# Altium schematic sheet Voltage Source.SchDoc
size A3; SheetNumber: 3; SheetTotal: 5
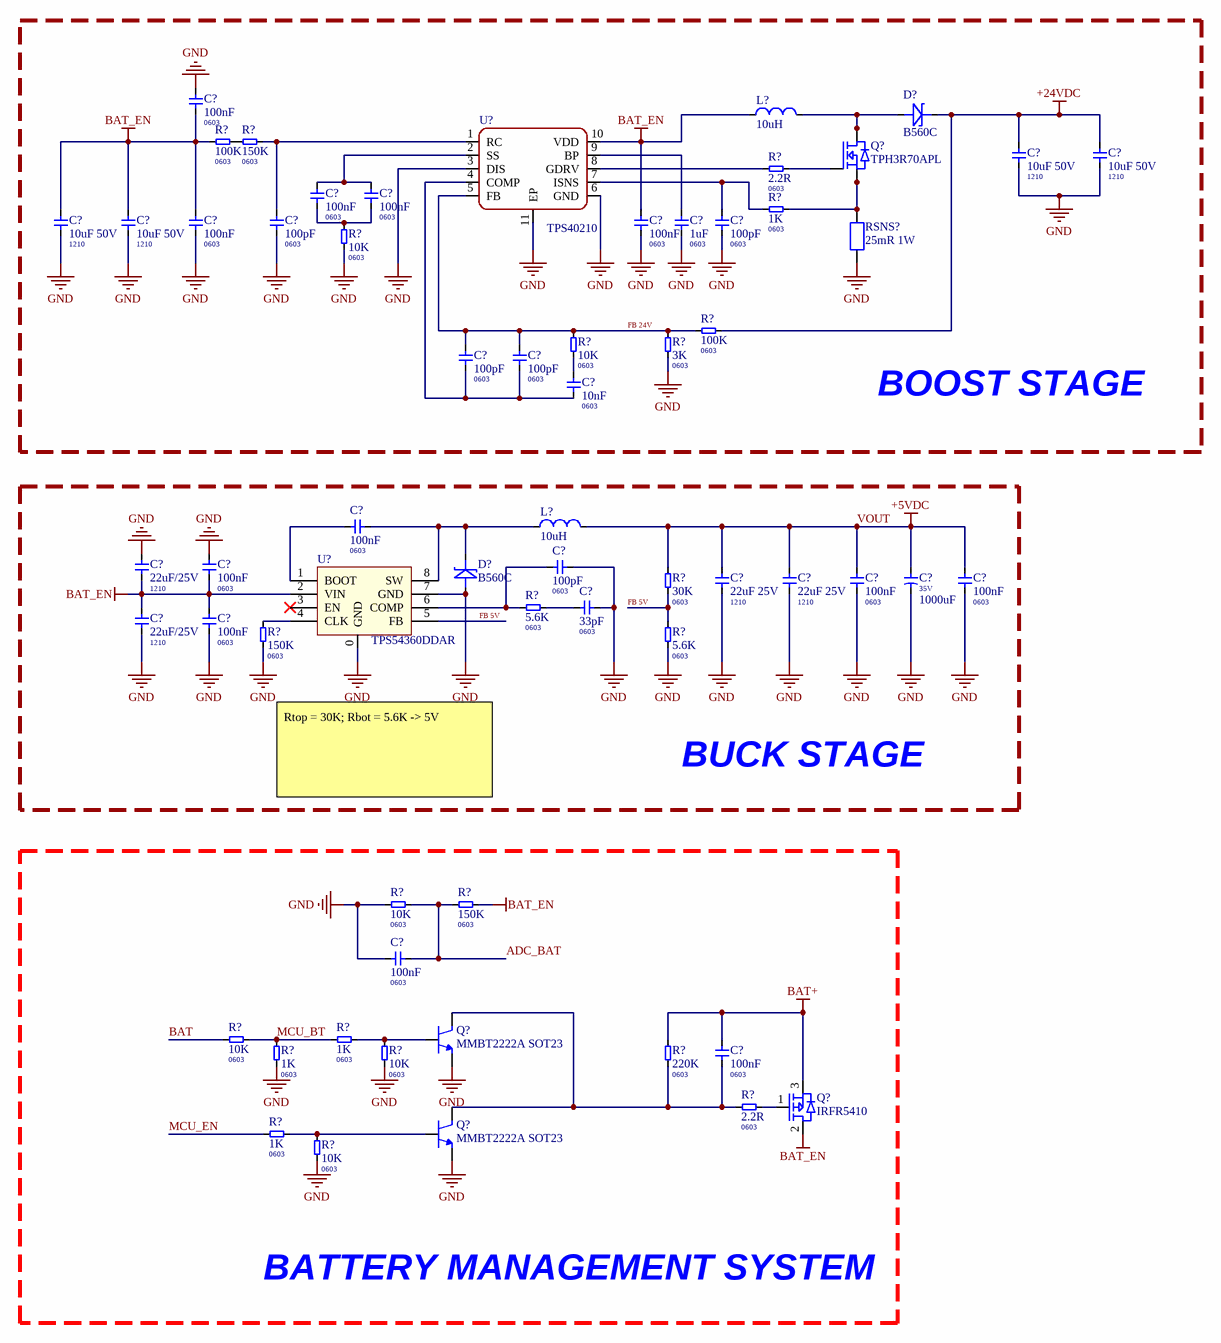
[diagram p0: Voltage Source.SchDoc]

## Parts
(Parts that share a designator on the sheet are numbered #1, #2 ... from top to bottom, then left to right.)
C?#1  100nF  Package: 0603  [0603 MLCC]
C?#2  10uF 50V  Package: 1210  [1210 CAPACITOR]
C?#3  10uF 50V  Package: 1210  [1210 CAPACITOR]
C?#4  100nF  Package: 0603  [0603 MLCC]
C?#5  100nF  Package: 0603  [0603 MLCC]
C?#6  10uF 50V  Package: 1210  [1210 CAPACITOR]
C?#7  10uF 50V  Package: 1210  [1210 CAPACITOR]
C?#8  100nF  Package: 0603  [0603 MLCC]
C?#9  100pF  Package: 0603  [0603 MLCC]
C?#10  100nF  Package: 0603  [0603 MLCC]
C?#11  1uF  Package: 0603  [0603 MLCC]
C?#12  100pF  Package: 0603  [0603 MLCC]
C?#13  100pF  Package: 0603  [0603 MLCC]
C?#14  100pF  Package: 0603  [0603 MLCC]
C?#15  10nF  Package: 0603  [0603 MLCC]
C?#16  100nF  Package: 0603  [0603 MLCC]
C?#17  22uF/25V  Package: 1210  [1210 CAPACITOR]
C?#18  100nF  Package: 0603  [0603 MLCC]
C?#19  100pF  Package: 0603  [0603 MLCC]
C?#20  22uF 25V  Package: 1210  [1210 CAPACITOR]
C?#21  22uF 25V  Package: 1210  [1210 CAPACITOR]
C?#22  100nF  Package: 0603  [0603 MLCC]
C?#23  Voltage: 35V  Capacitor: 1000uF  [10x20 5.0 Capacitor]  (hidden comment: 1000uF/35V)
C?#24  100nF  Package: 0603  [0603 MLCC]
C?#25  33pF  Package: 0603  [0603 MLCC]
C?#26  22uF/25V  Package: 1210  [1210 CAPACITOR]
C?#27  100nF  Package: 0603  [0603 MLCC]
C?#28  100nF  Package: 0603  [0603 MLCC]
C?#29  100nF  Package: 0603  [0603 MLCC]
D?#1  B560C  [SMC(DO-214AB)]
D?#2  B560C  [SMC(DO-214AB)]
L?#1  10uH  [12.2x12.2mm]
L?#2  10uH  [12.2x12.2mm]
Q?#1  TPH3R70APL  [SOP Advanced]
Q?#2  MMBT2222A SOT23  [SOT23_HVT]
Q?#3  IRFR5410  [TO - 252]
Q?#4  MMBT2222A SOT23  [SOT23_HVT]
R?#1  100K  Package: 0603  [0603 Resistors]
R?#2  150K  Package: 0603  [0603 Resistors]
R?#3  2.2R  Package: 0603  [0603 Resistors]
R?#4  1K  Package: 0603  [0603 Resistors]
R?#5  10K  Package: 0603  [0603 Resistors]
R?#6  100K  Package: 0603  [0603 Resistors]
R?#7  10K  Package: 0603  [0603 Resistors]
R?#8  3K  Package: 0603  [0603 Resistors]
R?#9  30K  Package: 0603  [0603 Resistors]
R?#10  5.6K  Package: 0603  [0603 Resistors]
R?#11  150K  Package: 0603  [0603 Resistors]
R?#12  5.6K  Package: 0603  [0603 Resistors]
R?#13  10K  Package: 0603  [0603 Resistors]
R?#14  150K  Package: 0603  [0603 Resistors]
R?#15  10K  Package: 0603  [0603 Resistors]
R?#16  1K  Package: 0603  [0603 Resistors]
R?#17  1K  Package: 0603  [0603 Resistors]
R?#18  10K  Package: 0603  [0603 Resistors]
R?#19  220K  Package: 0603  [0603 Resistors]
R?#20  2.2R  Package: 0603  [0603 Resistors]
R?#21  1K  Package: 0603  [0603 Resistors]
R?#22  10K  Package: 0603  [0603 Resistors]
RSNS?  25mR 1W  [1206 Resistor]
U?#1  TPS40210  [MSOP 10]
U?#2  TPS54360DDAR  [SOIC8]

## Blocks framed on the sheet
BOOST STAGE: C?#1-C?#15 D?#1 L?#1 Q?#1 R?#1-R?#8 RSNS? U?#1
BUCK STAGE: C?#16-C?#27 D?#2 L?#2 R?#9-R?#12 U?#2
BATTERY MANAGEMENT SYSTEM: C?#28 C?#29 Q?#2-Q?#4 R?#13-R?#22

## Nets
+24VDC: C?#2.2 C?#3.2 D?#1.2(Kathode) R?#6.2
BAT+: C?#29.2 Q?#3.3(S) R?#19.2
BAT_EN: C?#1.1 C?#6.2 C?#7.2 C?#8.1 C?#10.2 C?#17.1 C?#18.1 C?#26.1 C?#27.2 L?#1.1 Q?#3.2(D) R?#1.1 R?#14.2 U?#1.10(VDD) U?#2.2(VIN)
GND: C?#1.2 C?#2.1 C?#3.1 C?#6.1 C?#7.1 C?#8.2 C?#9.1 C?#10.1 C?#11.2 C?#12.1 C?#17.2 C?#18.2 C?#19.1 C?#20.1 C?#21.1 C?#22.1 C?#23.2 C?#24.1 C?#25.1 C?#26.2 C?#27.1 C?#28.2 D?#2.1(Anode) Q?#2.2(E) Q?#4.2(E) R?#5.1 R?#8.1 R?#11.1 R?#12.1 R?#13.2 R?#17.1 R?#18.1 R?#22.1 RSNS?.1 U?#1.3(DIS) U?#1.6(GND) U?#1.11(EP) U?#2.0(GND) U?#2.7(GND)
VOUT: C?#20.2 C?#21.2 C?#22.2 C?#23.1 C?#24.2 L?#2.2 R?#9.2  [also labelled +5VDC]
ADC_BAT: C?#28.1 R?#13.1 R?#14.1
BAT: R?#15.1
FB 5V: R?#9.1 R?#12.2 U?#2.5(FB)
FB 24V: C?#13.2 C?#14.2 R?#6.1 R?#7.2 R?#8.2 U?#1.5(FB)
MCU_BT: R?#15.2 R?#16.2 R?#17.2
MCU_EN: R?#21.2
NetC?#4_1: C?#4.1 C?#5.1 U?#1.2(SS)
NetC?#4_2: C?#4.2 C?#5.2 R?#5.2
NetC?#9_2: C?#9.2 R?#2.2 U?#1.1(RC)
NetC?#11_1: C?#11.1 U?#1.9(BP)
NetC?#12_2: C?#12.2 R?#4.1 U?#1.7(ISNS)
NetC?#13_1: C?#13.1 C?#14.1 C?#15.1 U?#1.4(COMP)
NetC?#15_2: C?#15.2 R?#7.1
NetC?#16_1: C?#16.1 D?#2.2(Kathode) L?#2.1 U?#2.8(SW)
NetC?#16_2: C?#16.2 U?#2.1(BOOT)
NetC?#19_2: C?#19.2 R?#10.1 U?#2.6(COMP)
NetC?#25_2: C?#25.2 R?#10.2
NetC?#29_1: C?#29.1 Q?#2.3(C) Q?#4.3(C) R?#19.1 R?#20.2
NetD?#1_1: D?#1.1(Anode) L?#1.2 Q?#1.5(D) Q?#1.6(D) Q?#1.7(D) Q?#1.8(D) Q?#1.TAB(D)
NetQ?#1_1: Q?#1.1(S) Q?#1.2(S) Q?#1.3(S) R?#4.2 RSNS?.2
NetQ?#1_4: Q?#1.4(G) R?#3.2
NetQ?#2_1: Q?#2.1(B) R?#16.1 R?#18.2
NetQ?#3_1: Q?#3.1(G) R?#20.1
NetQ?#4_1: Q?#4.1(B) R?#21.1 R?#22.2
NetR?#1_2: R?#1.2 R?#2.1
NetR?#3_1: R?#3.1 U?#1.8(GDRV)
NetR?#11_2: R?#11.2 U?#2.4(CLK)

Not connected (* = marked no-connect by the designer): U?#2 3(EN)*

## Notes on the sheet
- Rtop = 30K; Rbot = 5.6K -> 5V
- Author:
- Title:
- Size:
- A3
- Project:
- Revision:
- Modified Date:
- CheckedBy:
- Date:
- SW Version:

## Library data of the parts
C?#1 C?#4 C?#5 C?#8 C?#10 C?#16 C?#18 C?#22 C?#24 C?#27-C?#29 = 0603 100nF: 100nF ±10% 50V Ceramic Capacitor X7R 0603; Manufacturer: YAGEO; Mfr. Part #: CC0603KRX7R9BB104; LCSC Part #: C14663; ComponentLink1Description: LCSC Link; ComponentLink1URL: https://www.lcsc.com/product-detail/C14663.html?s_z=n_0603%2520100nF
C?#2 C?#3 C?#6 C?#7 = 1210 10uF 50V: 10uF ±10% 50V Ceramic Capacitor X7R 1210; Manufacturer: Samsung Electro-Mechanics; Mfr. Part #: CL32B106KBJNNNE; LCSC Part #: C138687; ComponentLink1Description: LCSC Link; ComponentLink1URL: https://www.lcsc.com/product-detail/C138687.html?s_z=n_1210%252010uF
C?#9 C?#12-C?#14 C?#19 = 0603 100pF: 100pF ±5% 50V Ceramic Capacitor C0G 0603; Manufacturer: Samsung Electro-Mechanics; Mfr. Part #: CL10C101JB8NNNC; LCSC Part #: C14858; ComponentLink1Description: LCSC Link; ComponentLink1URL: https://www.lcsc.com/product-detail/C14858.html?s_z=n_100pF%25200603&spm=wm.ssy.bg.0.xh&lcsc_vid=FVcIBVBRElIPBFdUFgBYX10HEQJbUQVVQANfV1wFQQcxVlNRQ1RWV1NSQ1dXXjsOAxUeFF5JWBYZEEoKFBINSQcJGk4eFQsCAgIaSgADAwAHC0slRVheUFRSQU8GEwkK
C?#11 = 0603 1uF: 1uF ±10% 50V Ceramic Capacitor X5R 0603; Manufacturer: Samsung Electro-Mechanics; Mfr. Part #: CL10A105KB8NNNC; LCSC Part #: C15849; ComponentLink1Description: LCSC Link; ComponentLink1URL: https://www.lcsc.com/product-detail/C15849.html?s_z=n_1uF%25200603%25201%2525&spm=wm.ssy.bg.0.xh&lcsc_vid=FVcIBVBRElIPBFdUFgBYX10HEQJbUQVVQANfV1wFQQcxVlNRQlFeXlNXT1hdUDsOAxUeFF5JWBYZEEoKFBINSQcJGk4%3D
C?#15 = 0603 10nF: 10nF ±10% 50V Ceramic Capacitor X7R 0603; Manufacturer: YAGEO; Mfr. Part #: CC0603KRX7R9BB103; LCSC Part #: C100042; ComponentLink1Description: LCSC Link; ComponentLink1URL: https://www.lcsc.com/product-detail/C100042.html?s_z=n_0603%252010nF&spm=wm.ssy.bg.0.xh&lcsc_vid=FVcIBVBRElIPBFdUFgBYX10HEQJbUQVVQANfV1wFQQcxVlNRQlFfVVBSRVNYXjsOAxUeFF5JWBYZEEoKFBINSQcJGk4eFQsCAgIaSgADAwAHC0slRFFaV1JQWQkaCgg%3D
C?#17 C?#26 = 1210 22uF 25V X7R: 22uF ±10% 25V Ceramic Capacitor X7R 1210; Manufacturer: Samsung Electro-Mechanics; Mfr. Part #: CL32B226KAJNNNE; LCSC Part #: C309062; ComponentLink1Description: LCSC Link; ComponentLink1URL: https://www.lcsc.com/product-detail/C309062.html?s_z=n_22uF%25201210
C?#20 C?#21 = 1210 22uF 25V: 22uF ±10% 25V Ceramic Capacitor X7R 1210; Manufacturer: Samsung Electro-Mechanics; Mfr. Part #: CL32B226KAJNNNE; LCSC Part #: C309062; ComponentLink1Description: LCSC Link; ComponentLink1URL: https://www.lcsc.com/product-detail/C309062.html?s_z=n_22uF%25201210
C?#23 = 10x20 1000uF 35V: 1000uF 35V Aluminum Electrolytic Capacitors Through Hole,D10xL20mm 2000hrs@105℃; Manufacturer: Rubycon; Mfr. Part #: 35PX1000MEFC10X20; LCSC Part #: C136014; ComponentLink1Description: LCSC Link; ComponentLink1URL: https://www.lcsc.com/product-detail/C136014.html?s_z=n_35V%25201000uF%2520rubycon; Package: Through Hole,D10xL20mm; Type: Capacitor; Assembly Type: DIP Assembly
C?#25 = 0603 33pF: 33pF ±5% 50V Ceramic Capacitor NP0 0603; Manufacturer: YAGEO; Mfr. Part #: CC0603JRNPO9BN330; LCSC Part #: C107047; ComponentLink1Description: LCSC Link; ComponentLink1URL: https://www.lcsc.com/product-detail/C107047.html?s_z=n_33pF%25200603&spm=wm.ssy.bg.0.xh&lcsc_vid=FVcIBVBRElIPBFdUFgBYX10HEQJbUQVVQANfV1wFQQcxVlNRQ1RWV1xeR1ZZUTsOAxUeFF5JWBYZEEoKFBINSQcJGk4dAgUUFAk%3D
D?#1 D?#2 = B560C - 13- F: Voltage： 60V Current： 5A; Manufacturer: DIODES; Mfr. Part #: B560C-13-F; LCSC Part #: C85100; Package: SMC(DO-214AB); ComponentLink1Description: LCSC Link; ComponentLink1URL: https://www.lcsc.com/product-detail/C85100.html?s_z=n_B560C
L?#1 L?#2 = CDRH127N 10uH: 5.4A 10uH 21.6mΩ ±20% SMD,12.2x12.2mm Fixed Inductors RoHS; Manufacturer: MINGSTAR; Mfr. Part #: CDRH127N-100M; LCSC Part #: C2832085; Package: SMD,12.2x12.2mm; ComponentLink1Description: LCSC Link; ComponentLink1URL: http://lcsc.com/product-detail/C2832085.html?s_z=n_CDRH127
Q?#1 = TPH3R70: Manufacturer: TOSHIBA; Mfr. Part #: TPH3R70APL; LCSC Part #: C556308; Package: SO-8; ComponentLink1Description: LCSC Link; ComponentLink1URL: https://www.lcsc.com/product-detail/C556308.html?s_z=n_tph3R70
Q?#2 Q?#4 = MMBT2222A: Bipolar (BJT) Transistor NPN 20V 350mA 300MHz 300mW Surface Mount SOT-23; Manufacturer: JSMSEMI; Mfr. Part #: MMBT2222A; LCSC Part #: C916372; Package: SOT-23; ComponentLink1Description: LCSC Link; ComponentLink1URL: https://www.lcsc.com/product-detail/C916372.html?s_z=n_mmbt222&spm=wm.ssy.bg.4.xh&lcsc_vid=FVcIBVBRElIPBFdUFgBYX10HEQJbUQVVQANfV1wFQQcxVlNRQ1hYVFJVRlldXjsOAxUeFF5JWBYZEEoKFBINSQcJGk4dAgUUFAk%3D
Q?#3 = IRFR5410TRPBF: P-Channel 100V 13A 66W Surface Mount DPAK(TO-252AA); Manufacturer: Infineon; Mfr. Part #: IRFR5410TRPBF; LCSC Part #: C3018; Package: DPAK(TO-252AA); ComponentLink1Description: LCSC Link; ComponentLink1URL: https://www.lcsc.com/product-detail/C3018.html?s_z=n_IRFR5410TRPBF
R?#1 R?#6 = 0603 100K: 100mW 100KΩ 75V Thick Film Resistor ±1% ±100ppm/℃ 0603 Chip Resistor - Surface Mount RoHS; Mfr. Part #: FRC0603F1003TS; Manufacturer: FOJAN; LCSC Part #: C2906980; ComponentLink1Description: LCSC Link; ComponentLink1URL: https://www.lcsc.com/product-detail/C2906980.html?s_z=n_0603%25201%2525%2520100K; Value: 100K
R?#2 R?#11 R?#14 = 0603 150K: 100mW 150KΩ 75V Thick Film Resistor ±1% ±100ppm/℃ 0603 Chip Resistor - Surface Mount RoHS; Mfr. Part #: 0603WAF1503T5E; Manufacturer: UNI-ROYAL; LCSC Part #: C22807; ComponentLink1Description: LCSC Link; ComponentLink1URL: https://www.lcsc.com/product-detail/C22807.html?s_z=n_0603%25201%2525%2520150K; Value: 150K
R?#3 R?#20 = 0603 2.2R: 100mW 2.2Ω 75V Thick Film Resistor ±1% ±100ppm/℃ 0603 Chip Resistor - Surface Mount RoHS; Mfr. Part #: FRC0805F2R20TS; Manufacturer: FOJAN; LCSC Part #: C2933402; ComponentLink1Description: LCSC Link; ComponentLink1URL: https://www.lcsc.com/product-detail/C2933402.html?s_z=n_2.2R%25201%2525&spm=wm.ssy.bg.6.xh&lcsc_vid=FVcIBVBRElIPBFdUFgBYX10HEQJbUQVVQANfV1wFQQcxVlNRQ1hYUFNVRlVWUzsOAxUeFF5JWBYZEEoKFBINSQcJGk4dAgUUFAk%3D; Value: 2.2R
R?#4 R?#16 R?#17 R?#21 = 0603 1K: 100mW 1kΩ 75V Thick Film Resistor ±1% ±100ppm/℃ 0603 Chip Resistor - Surface Mount RoHS; Mfr. Part #: CRCW06031K00FKEA; Manufacturer: VISHAY; LCSC Part #: C844920; ComponentLink1Description: LCSC Link; ComponentLink1URL: https://www.lcsc.com/product-detail/C844920.html?s_z=n_0603%25201K; Value: 1K
R?#5 R?#7 R?#13 R?#15 R?#18 R?#22 = 0603 10K: 100mW 10kΩ 75V Thick Film Resistor ±1% ±100ppm/℃ 0603 Chip Resistor - Surface Mount RoHS; Manufacturer: VISHAY; Mfr. Part #: CRCW060310K0FKEA; LCSC Part #: C844918; ComponentLink1Description: LCSC Link; ComponentLink1URL: https://www.lcsc.com/product-detail/C844918.html?s_z=n_10K
R?#8 = 0603 3K: 3kΩ ±1% 100mW 0603 Thick Film Resistor; Mfr. Part #: 0805W8F7503T5E; Manufacturer: UNI-ROYAL; LCSC Part #: C17817; ComponentLink1Description: LCSC Link; ComponentLink1URL: https://www.lcsc.com/product-detail/C2907033.html?s_z=n_3K%25201%2525%25200603&spm=wm.ssy.bg.0.xh&lcsc_vid=FVcIBVBRElIPBFdUFgBYX10HEQJbUQVVQANfV1wFQQcxVlNRQVBYUlZWRlRaUjsOAxUeFF5JWBYZEEoKFBINSQcJGk4dAgUUFAk%3D; ComponentLink2Description: Datasheet; ComponentLink2URL: https://www.lcsc.com/datasheet/C2907033.pdf?spm=wm.sxq.inf.ggs___wm.ssy.bg.0.xh&lcsc_vid=FVcIBVBRElIPBFdUFgBYX10HEQJbUQVVQANfV1wFQQcxVlNRQVBYUlZWRlRaUjsOAxUeFF5JWBYZEEoKFBINSQcJGk4dAgUUFAk%3D; Type: Resistor; Assembly Type: SMT Assembly; Value: 3K
R?#9 = 0603 30K: 30kΩ ±1% 100mW 0603 Thick Film Resistor; Mfr. Part #: FRC0603F3002TS; Manufacturer: FOJAN; LCSC Part #: C2907025; ComponentLink1Description: LCSC Link; ComponentLink1URL: https://www.lcsc.com/product-detail/C2907025.html?s_z=n_q_t_0603%252030K&spm=wm.fly.bg.0.xh___wm.ssy.tc.0.tz&lcsc_vid=QQBdBlYAQFFWUgBXTlUPAgFQQQIIBQIHEQIPAgJRQFAxVlNRT1daV1JVTlhbUzsOAxUeFF5JWBYZEEoKFBINSQcJGk4dAgUUFAk%3D; ComponentLink2Description: Datasheet; ComponentLink2URL: https://www.lcsc.com/datasheet/C2907025.pdf?spm=wm.sxq.inf.ggs___wm.fly.bg.0.xh&lcsc_vid=QQBdBlYAQFFWUgBXTlUPAgFQQQIIBQIHEQIPAgJRQFAxVlNRT1daV1JVTlhbUzsOAxUeFF5JWBYZEEoKFBINSQcJGk4dAgUUFAk%3D; Type: Resistor; Assembly Type: SMT Assembly; Value: 30K
R?#10 = 0603 5.6K: 100mW 5.6KΩ 75V Thick Film Resistor ±1% ±100ppm/℃ 0603 Chip Resistor - Surface Mount RoHS; Mfr. Part #: FRC0603F5601TS; Manufacturer: FOJAN; Value: 5.1K; LCSC Part #: C2907046; ComponentLink1Description: LCSC Link; ComponentLink1URL: https://www.lcsc.com/product-detail/C2907046.html?s_z=n_5.6K%25200603&spm=wm.ssy.bg.0.xh&lcsc_vid=FVcIBVBRElIPBFdUFgBYX10HEQJbUQVVQANfV1wFQQcxVlNRQ1RWV1FeQVlfVDsOAxUeFF5JWBYZEEoKFBINSQcJGk4eFQsCAgIaSgADAwAHC0slQ1VdUFNIHxUDCw%3D%3D
R?#12 = 0603 5.6K: 100mW 5.6KΩ 75V Thick Film Resistor ±1% ±100ppm/℃ 0603 Chip Resistor - Surface Mount RoHS; Mfr. Part #: FRC0603F5601TS; Manufacturer: FOJAN; LCSC Part #: C2907046; ComponentLink1Description: LCSC Link; ComponentLink1URL: https://www.lcsc.com/product-detail/C2907046.html?s_z=n_5.6K%25200603&spm=wm.ssy.bg.0.xh&lcsc_vid=FVcIBVBRElIPBFdUFgBYX10HEQJbUQVVQANfV1wFQQcxVlNRQ1RWV1FeQVlfVDsOAxUeFF5JWBYZEEoKFBINSQcJGk4eFQsCAgIaSgADAwAHC0slQ1VdUFNIHxUDCw%3D%3D; Value: 5.6K
R?#19 = 0603 220K: 100mW 220KΩ 75V Thick Film Resistor ±1% ±100ppm/℃ 0603 Chip Resistor - Surface Mount RoHS; Mfr. Part #: FRC0603F2203TS; Manufacturer: FOJAN; LCSC Part #: C2907013; ComponentLink1Description: LCSC Link; ComponentLink1URL: https://www.lcsc.com/product-detail/C2907013.html?s_z=n_0603%25201%2525%2520220K; Value: 220K
RSNS? = 1206 25mR: 1W 25mΩ ±50ppm/℃ ±1% 1206 Chip Resistor - Surface Mount RoHS; Manufacturer: JIERR; Mfr. Part #: JER1206F1R025; LCSC Part #: C46634441; Package: 1206; ComponentLink1Description: LCSC Link; ComponentLink1URL: https://www.lcsc.com/product-detail/C46634441.html?s_z=n_25mR%25201W&spm=wm.ssy.bg.1.stp&lcsc_vid=FVcIBVBRElIPBFdUFgBYX10HEQJbUQVVQANfV1wFQQcxVlNRQVBYVlFWT1lXVzsOAxUeFF5JWBYZEEoKFBINSQcJGk4eFQsCAgIaSgADAwAHC0slRlVZVVxIHxUDCw%3D%3D; ComponentLink2Description: Datasheet; ComponentLink2URL: https://www.lcsc.com/datasheet/C46634441.pdf?spm=wm.sxq.inf.ggs___wm.ssy.bg.1.stp&lcsc_vid=FVcIBVBRElIPBFdUFgBYX10HEQJbUQVVQANfV1wFQQcxVlNRQVBYVlFWT1lXVzsOAxUeFF5JWBYZEEoKFBINSQcJGk4eFQsCAgIaSgADAwAHC0slRlVZVVxIHxUDCw%3D%3D
U?#1 = TPS40210DGQR: 1 MSOP-10-EP DC DC Switching Controllers RoHS; Manufacturer: TI; Mfr. Part #: TPS40210DGQR; LCSC Part #: C14728; Package: MSOP-10-EP; ComponentLink1Description: LCSC Link; ComponentLink1URL: https://www.lcsc.com/product-detail/C14728.html?s_z=n_TPS40210&spm=wm.ssy.bg.0.xh&lcsc_vid=FVcIBVBRElIPBFdUFgBYX10HEQJbUQVVQANfV1wFQQcxVlNRQVBbX1FeRllYUDsOAxUeFF5JWBYZEEoKFBINSQcJGk4dAgUUFAk%3D; Type: IC; Assembly Type: SMT Assembly; ComponentLink2Description: Datasheet; ComponentLink2URL: https://www.lcsc.com/datasheet/C14728.pdf?spm=wm.sxq.inf.ggs___wm.ssy.bg.0.xh&lcsc_vid=FVcIBVBRElIPBFdUFgBYX10HEQJbUQVVQANfV1wFQQcxVlNRQVBbX1FeRllYUDsOAxUeFF5JWBYZEEoKFBINSQcJGk4dAgUUFAk%3D
U?#2 = TPS54360: 60V Input, 3.5A Output Step-Down DC-DC Converter; Manufacturer: TI; Mfr. Part #: TPS54360DDAR; LCSC Part #: C44377; Package: SOIC-8-EP; ComponentLink1Description: LCSC Link; ComponentLink1URL: https://www.lcsc.com/product-detail/C44377.html?s_z=n_tps54360&spm=wm.ssy.bg.0.xh&lcsc_vid=FVcIBVBRElIPBFdUFgBYX10HEQJbUQVVQANfV1wFQQcxVlNRQ1RWV1ZTTlRdVzsOAxUeFF5JWBYZEEoKFBINSQcJGk4dAgUUFAk%3D